# EAGLE design ! NES_IO_US_SNES_REV1.5 (EAGLE 9.1.3)
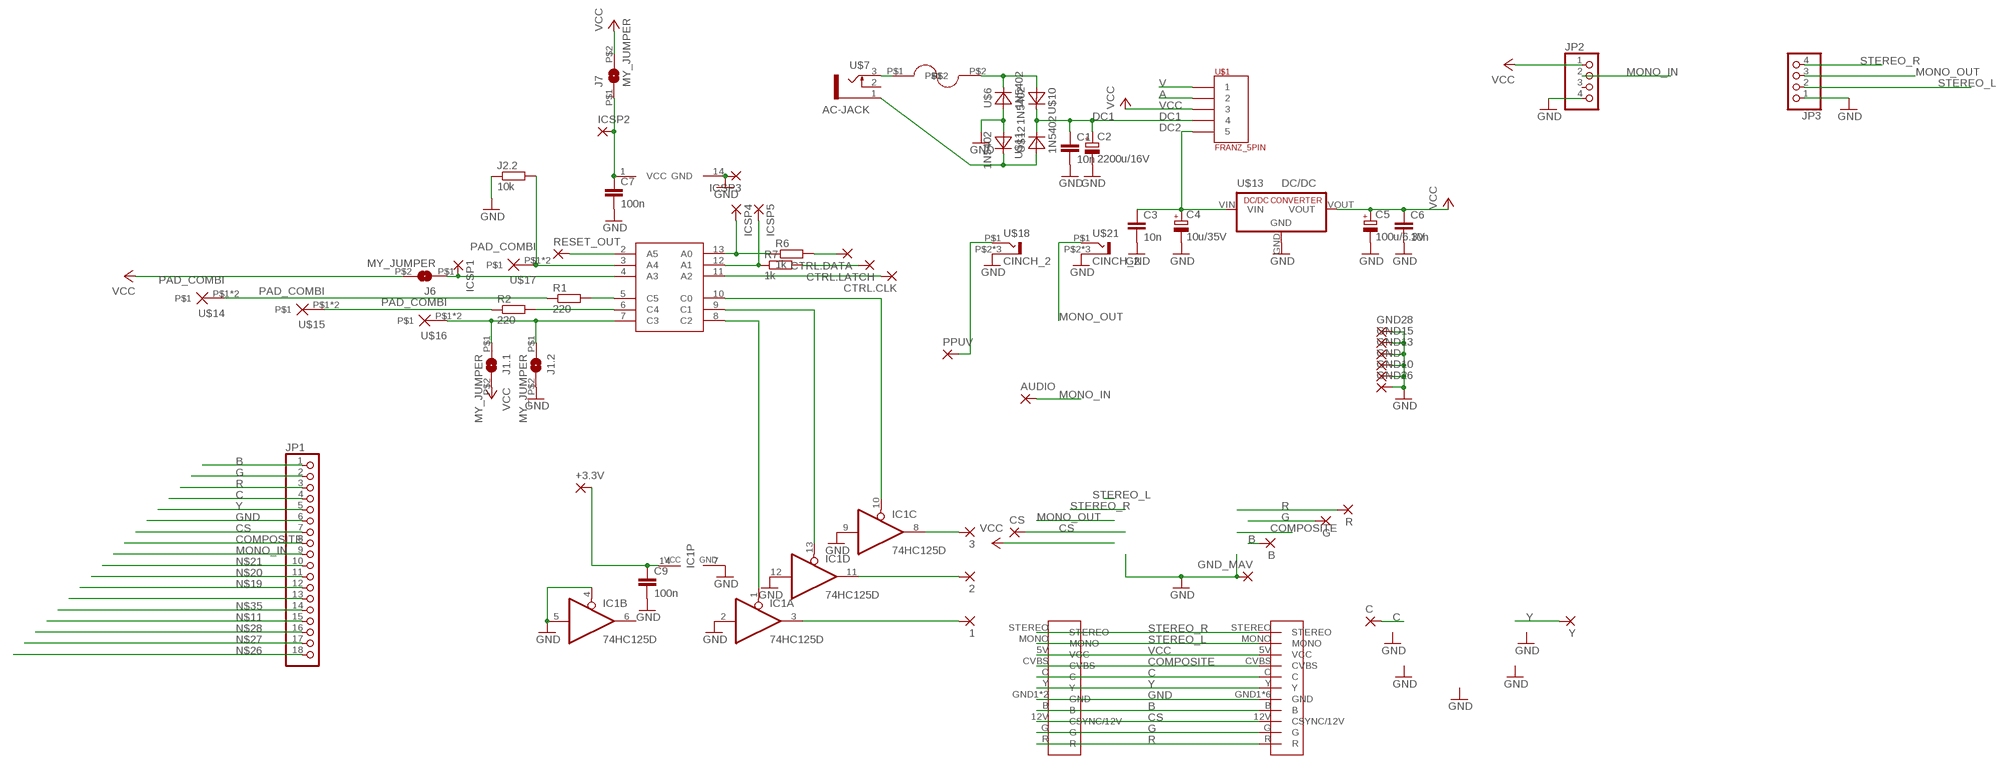
[diagram p0: schematic, sheet 1]

## Parts
1  SMD2  [SMD1,27-2,54]
2  SMD2  [SMD1,27-2,54]
3  SMD2  [SMD1,27-2,54]
+3.3V  SMD2  [SMD1,27-2,54]
AUDIO  SMD2  [SMD1,27-2,54]
B  SMD2  [SMD1,27-2,54]
C  SMD2  [SMD1,27-2,54]
C1  10n  C0805  [Z0805]
C2  2200u/16V  CPOL-EUE5-13  [E5-13]
C3  10n  C0805  [Z0805]
C4  10u/35V  CPOL-EUB  [PANASONIC_B]
C5  100u/6.3V  CPOL-EUD  [PANASONIC_D]
C6  10n  C0805  [Z0805]
C7  100n  C0805  [Z0805]
C9  100n  C0805  [Z0805]
CS  SMD2  [SMD1,27-2,54]
CTRL.CLK  SMD2  [SMD1,27-2,54]
CTRL.DATA  SMD2  [SMD1,27-2,54]
CTRL.LATCH  SMD2  [SMD1,27-2,54]
G  SMD2  [SMD1,27-2,54]
GND  SMD5  [SMD2,54-5,08]
GND10  SMD5  [SMD2,54-5,08]
GND13  SMD5  [SMD2,54-5,08]
GND15  SMD5  [SMD2,54-5,08]
GND26  SMD5  [SMD2,54-5,08]
GND28  SMD5  [SMD2,54-5,08]
GND_MAV  SMD2  [SMD1,27-2,54]
IC1  74HC125D  [SO14]
ICSP1  1,6/0,8  [1,6/0,8]
ICSP2  1,6/0,8  [1,6/0,8]
ICSP3  1,6/0,8  [1,6/0,8]
ICSP4  1,6/0,8  [1,6/0,8]
ICSP5  1,6/0,8  [1,6/0,8]
J1.1  MY_JUMPER  [MYJUMP]
J1.2  MY_JUMPER  [MYJUMP]
J2.2  10k  R0805  [Z0805]
J6  MY_JUMPER  [MYJUMP]
J7  MY_JUMPER  [MYJUMP]
JP1  PINHD-1X18_2.00  [1X18M]
JP2  PINHD-1X04_2.54-S  [1X04-S]
JP3  PINHD-1X04_2.54-S  [1X04-S]
PPUV  SMD2  [SMD1,27-2,54]
R  SMD2  [SMD1,27-2,54]
R1  220  R0805  [Z0805]
R2  220  R0805  [Z0805]
R6  1k  R0805  [Z0805]
R7  1k  R0805  [Z0805]
RESET_OUT  SMD2  [SMD1,27-2,54]
U$1  FRANZ_5PIN  [5X2.22RM4]
U$2  FUSEHOLDER  [FUSEHOLDER]
U$5  PIC16F630_SIMPLE  [PIC16F630]
U$6  1N5402  [DO201]
U$7  AC-JACK  [AC-JACK]
U$10  1N5402  [DO201]
U$11  1N5402  [DO201]
U$12  1N5402  [DO201]
U$13  DC/DC  [RECOM]
U$14  PAD_COMBI  [PAD_COMBI]
U$15  PAD_COMBI  [PAD_COMBI]
U$16  PAD_COMBI  [PAD_COMBI]
U$17  PAD_COMBI  [PAD_COMBI]
U$18  CINCH_2  [CINCH_2]
U$19  GC-MULTIAV  [GC-MULTIAV]
U$20  SNES-MULTIAV2  [SNES-MULTIAV2]
U$21  CINCH_2  [CINCH_2]
Y  SMD2  [SMD1,27-2,54]

## Nets
A: U$1.P$2
AC1A: U$2.P$1 U$7.3
AC1B: U$2.P$2 U$6.C U$10.A
AC2: U$7.1 U$11.C U$12.A
B: B.1(P) JP1.1 U$19.B U$20.B
C: C.1(P) JP1.4 U$19.C U$20.C
COMPOSITE: JP1.8 PPUV.1(P) U$18.P$1(T) U$19.CVBS U$20.CVBS
CS: CS.1(P) JP1.7 U$19.12V(CSYNC/12V) U$20.12V(CSYNC/12V)
DC1: C1.1 C2.+ U$1.P$4 U$10.C U$12.C
DC2: C3.1 C4.+ U$1.P$5 U$13.VIN
G: G.1(P) JP1.2 U$19.G U$20.G
GND: C1.2 C2.- C3.2 C4.- C5.- C6.2 C7.2 C9.2 GND10.1(P) GND13.1(P) GND15.1(P) GND26.1(P) GND28.1(P) GND.1(P) GND_MAV.1(P) IC1.2(A:I) IC1.4(B:OE) IC1.5(B:I) IC1.7(P:GND) IC1.9(C:I) IC1.12(D:I) ICSP3.1(P) J1.2.P$2 J2.2.1 JP1.6 JP2.4 JP3.1 U$5.14(GND) U$6.A U$11.A U$13.GND U$18.P$2(S) U$18.P$3(S) U$18.P$4(S) U$19.GND1(GND) U$19.GND2(GND) U$19.GND3(GND) U$19.GND4(GND) U$19.GND5(GND) U$19.GND6(GND) U$20.GND1(GND) U$20.GND2(GND) U$21.P$2(S) U$21.P$3(S) U$21.P$4(S)
MONO_IN: AUDIO.1(P) JP1.9 JP2.2
MONO_OUT: JP3.3 U$21.P$1(T)
N$11: 3.1(P) IC1.8(C:O) JP1.15
N$12: J2.2.2 U$5.3(A4) U$17.P$1 U$17.P$2
N$13: R1.2 U$5.5(C5)
N$14: R2.2 U$5.6(C4)
N$15: R1.1 U$14.P$1 U$14.P$2
N$16: R2.1 U$15.P$1 U$15.P$2
N$17: J1.1.P$1 J1.2.P$1 U$5.7(C3) U$16.P$1 U$16.P$2
N$19: CTRL.DATA.1(P) JP1.12 R6.2
N$20: CTRL.LATCH.1(P) JP1.11 R7.2
N$21: CTRL.CLK.1(P) JP1.10 U$5.11(A2)
N$23: IC1.10(C:OE) U$5.10(C0)
N$24: IC1.13(D:OE) U$5.9(C1)
N$25: IC1.1(A:OE) U$5.8(C2)
N$26: +3.3V.1(P) C9.1 IC1.14(P:VCC) JP1.18
N$27: 1.1(P) IC1.3(A:O) JP1.17
N$28: 2.1(P) IC1.11(D:O) JP1.16
N$29: JP1.13
N$31: C7.1 ICSP2.1(P) J7.P$1 U$5.1(VCC)
N$32: ICSP1.1(P) J6.P$1 U$5.4(A3)
N$33: ICSP4.1(P) R6.1 U$5.13(A0)
N$34: ICSP5.1(P) R7.1 U$5.12(A1)
N$35: JP1.14 RESET_OUT.1(P) U$5.2(A5)
R: JP1.3 R.1(P) U$19.R U$20.R
STEREO_L: JP3.2 U$19.MONO U$20.MONO
STEREO_R: JP3.4 U$19.STEREO U$20.STEREO
V: U$1.P$1
VCC: C5.+ C6.1 J1.1.P$2 J6.P$2 J7.P$2 JP2.1 U$1.P$3 U$13.VOUT U$19.5V(VCC) U$20.5V(VCC)
Y: JP1.5 U$19.Y U$20.Y Y.1(P)
Unconnected: IC1.6(B:O) JP2.3 U$7.2

## Library data of the parts
1-3 +3.3V AUDIO B C CS CTRL.CLK CTRL.DATA CTRL.LATCH G GND_MAV PPUV R RESET_OUT Y = wirepad:SMD2: SMD PAD
C1 C3 C6 C7 C9 = snes_div:C0805
C2 = resistor:CPOL-EU: POLARIZED CAPACITOR, European symbol
C4 C5 = rcl:CPOL-EU: POLARIZED CAPACITOR, European symbol
GND GND10 GND13 GND15 GND26 GND28 = wirepad:SMD5: SMD PAD
IC1 = 74xx-eu:74*125: Quad bus BUFFER, 3-state
ICSP1-ICSP5 = wirepad:1,6/0,8: THROUGH-HOLE PAD
J1.1 J1.2 J6 J7 = snes_div:MY_JUMPER
J2.2 R1 R2 R6 R7 = snes_div:R0805
JP1 = pinhead-2:PINHD-1X18: PIN HEADER
JP2 JP3 = pinhead-2:PINHD-1X04: PIN HEADER
U$1 = schnaustlib:FRANZ_5PIN
U$2 = nintendo:FUSEHOLDER
U$5 = snes_div:PIC16F630_SIMPLE
U$6 U$10-U$12 = nintendo:1N5402
U$7 = nintendo:AC-JACK
U$13 = nintendo:DC/DC
U$14-U$17 = MS_Mod:PAD_COMBI
U$18 U$21 = nintendo:CINCH_2
U$19 = nintendo:GC-MULTIAV
U$20 = nintendo:SNES-MULTIAV2

## Board
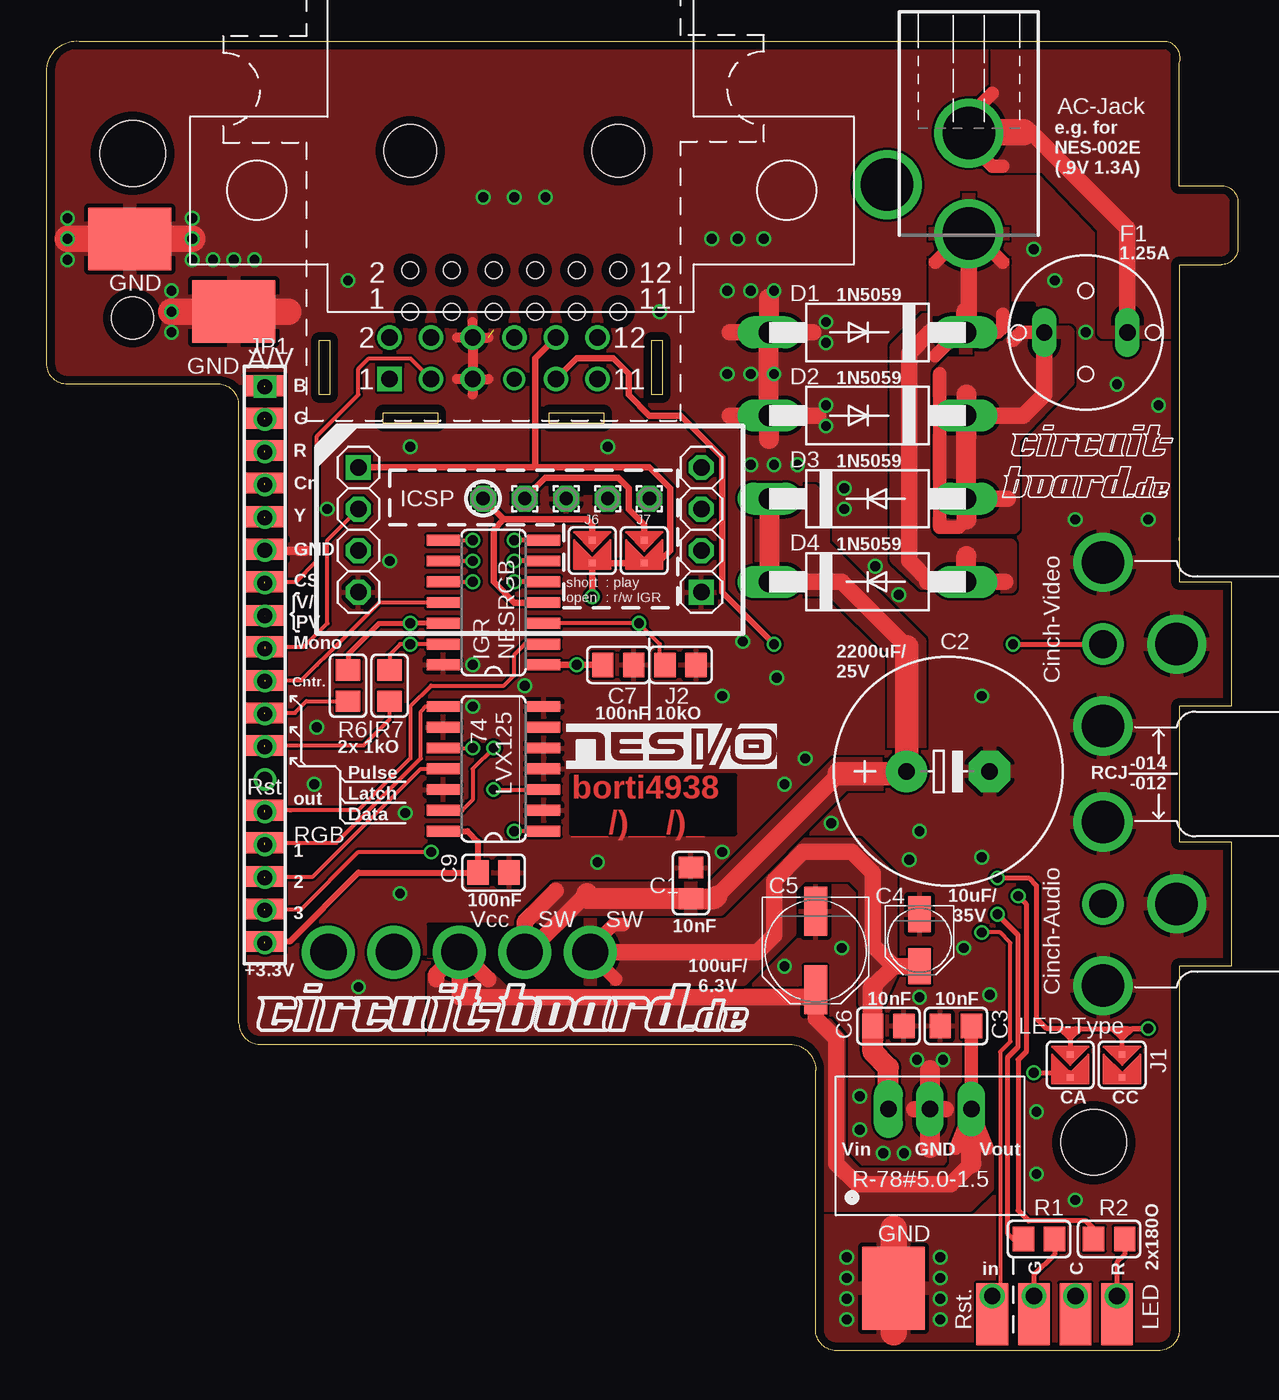
[diagram p1: board, top side]
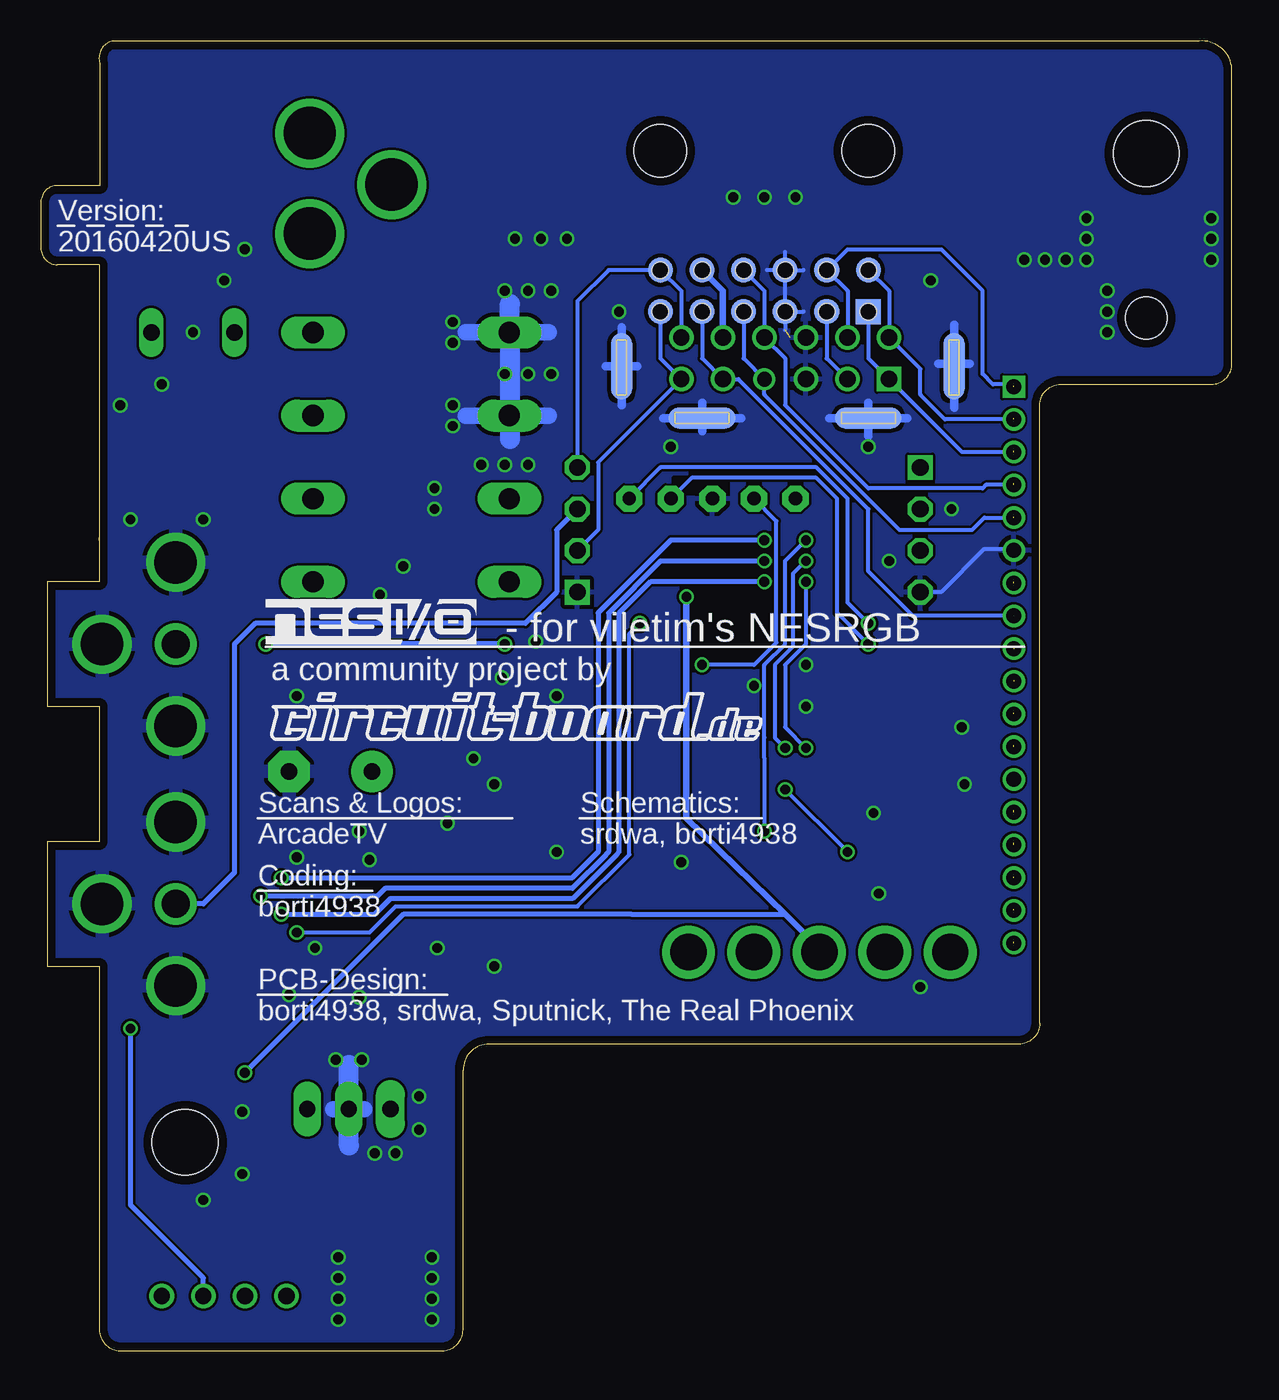
[diagram p2: board, bottom side, seen from below]

Size 72.79 x 80.04 mm. Coordinates in mm from the lower left corner, seen from the top.
Outline: 69.22,49.69 69.22,66.37 71.79,66.37 arc90 72.79,67.37 72.79,70.2 arc90 71.79,71.2 69.19,71.2 69.19,78.67 arc90 68.46,80.04 2,80.04 arc90 0,78.36 0,60.96 0,60.33 arc90 1.27,59.05 10.48,59.05 arc-90 11.75,57.78 11.75,20 arc90 13.02,18.73 45.4,18.73 arc-90 46.99,17.14 46.99,1.27 arc90 48.26,0 67.94,0 arc90 69.22,1.27 69.22,23.5 72.39,23.5 72.39,31.11 69.22,31.11 69.22,39.37 72.39,39.37 72.39,46.99 69.22,46.99 69.22,49.53
Outline: 69.22,49.69 69.22,49.53
Outline: 69.22,49.53 arc-7 69.22,49.69
Copper layers (1*16): Top 0.035mm / dielectric 1.6mm / Bottom 0.035mm
Design rules "Elecrow_2-layer_PCB_eagle_rule": minimum track width 6mil, minimum drill 12mil, track to track 6mil, track to pad 6mil, pad to pad 6mil, via to via 8mil, smd to smd 0mil, copper to edge 20mil, drill to drill 10mil, minimum pad ring 6mil, minimum via ring 6mil, stop-mask expansion 0mil, vias tented up to drill 100mil, thermal gap 10mil
Holes 4 mm at 5.25,73.16 63.98,12.73
Holes 2.54 mm at 5.25,63.11
tRestrict: area 61.9,10.7 to 66,14.7; area 3.2,71.2 to 7.3,75.2; area 23.3,24.1 to 28.1,26; area 30.8,52.4 to 34.1,53.3; area 12.1,24.3 to 14.6,59.7; area 59.1,62.5 to 60.3,64; area 57.3,13.3 to 58.6,20.6
bRestrict: area 61.9,10.7 to 66,14.7; area 3.2,71.2 to 7.3,75.2; area 30.8,52.4 to 34.1,53.3

### Footprints (pad centres in the part's own frame; a part is rotated, then mirrored left to right if it is on the bottom)
SMD1,27-2,54 = smd 1.27 x 2.54: 1 0,0
Z0805 = smd 1.3 x 1.5: 1 -0.95,0; 2 0.95,0
E5-13 = drill 1.016 pad 2.54: + -2.54,0 | drill 1.016 pad 2.54 octagon: - 2.54,0
PANASONIC_B = smd 2.2 x 1.4: + 1.6,0; - -1.6,0
PANASONIC_D = smd 3 x 1.4: + 2.4,0; - -2.4,0
SMD2,54-5,08 = smd 2.54 x 5.08: 1 0,0
SO14 = smd 0.66 x 2.032: 1 -3.81,-3.073; 2 -2.54,-3.073; 3 -1.27,-3.073; 4 0,-3.073; 5 1.27,-3.073; 6 2.54,-3.073; 7 3.81,-3.073; 8 3.81,3.073; 9 2.54,3.073; 10 1.27,3.073; 11 0,3.073; 12 -1.27,3.073; 13 -2.54,3.073; 14 -3.81,3.073
1,6/0,8 = drill 0.813 pad 1.6 octagon: 1 0,0
MYJUMP = smd 0.406 x 0.406: P$1 -0.635,0; P$2 0.765,0
1X18M = drill 0.914 square: 1 -17,0 | drill 0.914: 2 -15,0; 3 -13,0; 4 -11,0; 5 -9,0; 6 -7,0; 7 -5,0; 8 -3,0; 9 -1,0; 10 1,0; 11 3,0; 12 5,0; 13 7,0; 14 9,0; 15 11,0; 16 13,0; 17 15,0; 18 17,0
1X04-S = drill 1.016 square: 1 -3.81,0 | drill 1.016 octagon: 2 -1.27,0; 3 1.27,0; 4 3.81,0
5X2.22RM4 = drill 2.22: P$1 -8,0; P$2 -4,0; P$3 0,0; P$4 4,0; P$5 8,0
FUSEHOLDER = drill 1 pad 1.422 long: P$1 -2.54,0; P$2 2.54,0
PIC16F630 = smd 0.66 x 2.032: 1 -3.81,-3.073; 2 -2.54,-3.073; 3 -1.27,-3.073; 4 0,-3.073; 5 1.27,-3.073; 6 2.54,-3.073; 7 3.81,-3.073; 8 3.81,3.073; 9 2.54,3.073; 10 1.27,3.073; 11 0,3.073; 12 -1.27,3.073; 13 -2.54,3.073; 14 -3.81,3.073
DO201 = drill 1.3 long: A 6,0; C -6,0
AC-JACK = drill 3.2 pad 4: 1 0,8.57; 2 5,5.57; 3 0,2.42
RECOM = drill 1 pad 1.676 long: GND 0,0; VOUT 2.54,0 | drill 1 pad 1.778 long: VIN -2.54,0
PAD_COMBI = smd 1.93 x 3.81: P$1 0,0 | drill 1: P$2 0,1.111
CINCH_2 = drill 1.7: P$1 0,-4.5 | drill 2.6: P$2 -5,-4.5; P$3 5,-4.5; P$4 0,0
GC-MULTIAV = drill 1: 5V 15.24,5.08; 12V 7.62,2.54; B 7.62,5.08; C 12.7,5.08; CVBS 15.24,2.54; G 5.08,5.08; GND1 10.16,2.54; GND2 10.16,5.08; MONO 17.78,2.54; STEREO 17.78,5.08 | smd 1.27 x 4.064 bottom: GND3 1.111,3.334; GND6 21.431,3.334 | smd 4.064 x 1.27 bottom: GND4 6.35,0.159; GND5 16.51,0.159 | drill 1 square: R 5.08,2.54 | drill 0.9: Y 12.7,2.54
SNES-MULTIAV2 = smd 1.524 x 1.524 bottom: 5V 15.24,2.54; 12V 7.62,0; B 7.62,2.54; C 12.7,2.54; CVBS 15.24,0; G 5.08,2.54; GND1 10.16,0; GND2 10.16,2.54; MONO 17.78,0; R 5.08,0; STEREO 17.78,2.54; Y 12.7,0 | hole 3.2: 5.08,9.842; 17.78,9.842 | hole 1: 5.08,0; 5.08,2.54; 7.62,2.54; 10.16,2.54; 12.7,2.54; 12.7,0; 10.16,0; 7.62,0; 15.24,2.54; 17.78,2.54; 17.78,0; 15.24,0

### Placement (x,y rotation side)
1  13.34,26.99 270 top
2  13.34,28.97 270 top
3  13.34,31.04 270 top
+3.3V  13.34,25 90 top
AUDIO  13.34,43.02 90 top
B  13.34,58.98 90 top
C  13.34,53.02 90 top
C1  39.37,28.57 90 top
C2  55.09,35.4 0 top
C3  51.44,19.84 0 top
C4  53.34,25.08 270 top
C5  46.99,24.45 270 top
C6  55.56,19.84 180 top
C7  34.92,41.91 0 top
C9  27.3,29.21 0 top
CS  13.34,46.99 90 top
CTRL.CLK  13.34,40.96 270 top
CTRL.DATA  13.34,36.99 270 top
CTRL.LATCH  13.34,38.97 270 top
G  13.34,56.99 90 top
GND  5.08,68.58 90 top
GND10  51.12,3.81 180 top
GND13  52.39,3.81 0 top
GND15  11.43,62.87 90 top
GND26  11.43,64.14 90 top
GND28  5.08,67.31 90 top
GND_MAV  13.34,48.97 270 top
IC1  27.3,35.56 90 top
ICSP1  26.67,52.07 0 top
ICSP2  29.21,52.07 0 top
ICSP3  31.75,52.07 0 top
ICSP4  34.29,52.07 0 top
ICSP5  36.83,52.07 0 top
J1.1  62.55,17.46 270 top
J1.2  65.72,17.46 270 top
J2.2  38.73,41.91 180 top
J6  33.34,48.9 270 top
J7  36.51,48.9 270 top
JP1  13.34,41.91 270 top
JP2  19.05,50.16 270 top
JP3  40.01,50.16 90 top
PPUV  13.34,44.93 90 top
R  13.34,55.01 90 top
R1  60.64,6.83 180 top
R2  64.93,6.83 180 top
R6  20.95,40.64 270 top
R7  18.41,40.64 270 top
RESET_OUT  13.34,33.02 90 top
U$1  25.21,24.36 0 top
U$2  63.5,62.23 180 top
U$3  [NESIO-LOGO]  31.75,35.56 0 top
U$4  [NESIO-LOGO]  59.05,43.18 0 bottom
U$5  27.3,45.72 90 top
U$6  50.16,57.15 180 top
U$7  56.36,76.83 180 top
U$10  50.16,52.07 0 top
U$11  50.16,62.23 180 top
U$12  50.16,46.99 0 top
U$13  53.98,14.76 0 top
U$14  60.33,2.22 0 top
U$15  65.41,2.22 0 top
U$16  62.87,2.22 0 top
U$17  57.78,2.22 0 top
U$18  69.06,43.18 270 top
U$19  15.88,56.83 0 top
U$20  17.14,63.5 0 top
U$21  69.06,27.3 270 top
Y  13.34,50.96 90 top

### Tracks (layer width: path | path; a pad name or v marks a point on that pad's centre or on a via)
AC1A
  Top 0.813: 56.2,74.61 56.2,75.25 | 56.2,75.25 57.78,76.83 | 56.2,75.25 55.72,74.77 55.72,74.45 57.78,72.39 58.42,72.39
  Top 1.016: U$7.3 60.17,74.45 66.04,68.58 U$2.P$1
  Top 1.626: 59.69,74.45 56.2,74.45 56.2,74.61 56.2,74.77 56.04,74.61 56.04,74.45
  pour Top: 58.1,72.39 58.1,81.28 69.37,81.28 72.87,77.79 72.87,62.23 64.61,62.23 64.61,68.58 60.96,72.39
AC1B
  Top 0.813: U$2.P$2 59.53,62.23 59.05,61.75 | 54.58,59.69 54.58,50.32 55.72,50.32 56.2,50.8
  Top 1.016: U$6.C 56.2,57.15 59.69,57.15 60.96,58.42 60.96,61.75 | 56.2,52.07 58.74,52.07
  Top 1.219: U$6.C U$10.A | 56.2,52.07 56.2,50.8 | 56.2,55.88 56.2,57.15 56.2,58.42
  pour Top (rank 2): 54.29,50.32 59.05,50.32 59.05,55.72 62.39,59.21 62.39,62.23 59.53,62.23 57.63,60.64 55.09,60.64 54.29,59.85
AC2
  Top 0.813: 58.42,66.52 56.36,68.58 56.12,68.34 | 56.12,68.34 54.29,66.52 | U$7.1 56.12,68.27 56.12,68.34 | 56.2,62.23 58.1,62.23 58.42,62.55 58.42,63.34 | 54.29,60.8 55.88,62.39
  Top 1.016: U$7.1 56.36,62.23 56.2,62.23 U$11.C 53.98,62.23 52.7,60.96 52.7,48.26 53.98,46.99 U$12.A | 58.58,46.99 53.82,46.99
  Top 1.219: 56.2,62.23 56.2,63.5 | 56.2,46.99 56.2,48.58
  pour Top: 57.15,70.33 55.56,70.33 54.29,69.06 54.29,63.66 51.91,61.28 51.91,48.42 53.82,46.67 58.9,46.67 58.9,49.21 54.29,49.21 53.66,49.85 53.66,60.17 54.77,61.28 57.15,61.28 58.42,62.55 58.42,69.06
B  (1 unrouted)
  Bottom 0.254: U$19.B 23.5,64.77 U$20.B 23.5,67.31 17.78,67.31 15.24,64.77 15.24,59.69 14.61,59.05 13.48,59.05 JP1.1
C  (1 unrouted)
  Bottom 0.254: U$20.C 28.57,64.77 U$19.C 27.3,60.64 27.3,57.78 22.23,52.7 15.24,52.7 15.04,52.91 JP1.4
COMPOSITE  (via drill 0.6)  (1 unrouted)
  Top 0.305: v59.05,43.18 U$18.P$1
  Top 0.406: U$19.CVBS 32.38,60.64 34.61,60.64 35.56,59.69 35.56,58.42 36.83,57.15 38.73,57.15 41.27,54.61 41.27,46.35 v44.45,43.18
  Bottom 0.254: U$20.CVBS 32.38,60.64 U$19.CVBS 30.16,59.37 22.23,51.44 22.23,47.62 19.51,44.91 JP1.8
  Bottom 0.406: v59.05,43.18 46.07,43.18 46.05,43.17 46.04,43.18 v44.45,43.18
CS  (1 unrouted)
  Top 0.254: CS.1 15.24,46.99 16.51,48.26 16.51,55.88 19.05,58.42 19.05,60.01 19.68,60.64 22.23,60.64 U$19.12V
  Bottom 0.254: U$19.12V 24.77,60.64 U$20.12V
DC1
  Top 0.813: 29.21,26.35 29.53,26.67
  Top 1.016: U$12.C 48.58,46.99 52.55,43.02 | 48.42,35.24 40.96,27.78 | U$1.P$4 | 32.7,27.62 29.21,24.13 29.21,26.19 31.11,28.1
  Top 1.219: U$10.C U$12.C
  Top 1.27: 33.02,27.94 33.02,27.62 C1.1 40.8,27.62 40.96,27.78
  Top 1.422: 52.55,43.02 C2.+ | 52.55,35.24 48.42,35.24
  pour Top: 43.66,46.51 43.66,52.55 46.83,52.55 47.47,51.91 47.47,49.21 53.34,43.34 53.34,35.88 52.7,34.61 48.74,34.61 41.12,26.99 32.23,26.99 30.16,24.92 30.16,24.45 27.94,24.45 27.94,25.08 31.11,28.26 40.64,28.26 48.26,35.88 51.12,35.88 51.75,36.51 51.75,42.7 47.94,46.51
DC2
  Top 0.406: 53.35,23.5 C4.+
  Top 0.813: 35.24,26.04 34.61,26.04 33.02,24.45 34.77,22.7
  Top 1.016: U$1.P$5 43.41,24.36 44.45,25.4 44.45,28.73 46.2,30.48 49.21,30.48 50.48,29.21 50.48,24.77 51.75,23.5 | 51.75,23.5 53.33,23.5 C4.+ | 50.48,22.23 51.75,23.5 | 50.48,19.05 C3.1
  Top 1.219: C3.1 50.48,22.23
  Top 1.27: U$13.VIN 51.44,17.3 50.48,18.26 50.48,19.05
  pour Top (rank 2): 42.55,22.7 33.02,22.7 33.02,26.19 41.27,26.19 46.04,30.96 49.53,30.96 51.59,28.89 51.59,23.02 50.8,21.27 50.01,21.27 50.01,28.26 49.21,29.05 46.2,29.05 45.4,28.26 45.4,25.56
G  (1 unrouted)
  Bottom 0.254: U$20.G 20.95,64.77 U$19.G 19.05,60.01 19.05,58.42 17.54,56.91 JP1.2
GND  (via drill 0.6)  (1 unrouted)
  Top 0.508: GND_MAV.1 13.41,48.9 15.32,48.9
  Top 0.61: U$19.GND2 U$19.GND1 | U$19.GND1 26.04,58.42 | U$19.GND1 25.08,59.37 | U$19.GND1 26.99,59.37 | U$19.GND2 25.08,61.91 | U$19.GND2 26.99,61.91 | U$19.GND2 26.04,62.87 | 15.32,48.9 15.88,48.9
  Top 1.016: 10.16,64.14 GND26.1 | 41.75,57.15 44.13,57.15 47.15,57.15 | 46.83,62.23 44.13,62.23 41.75,62.23 | 53.02,14.76 U$13.GND 54.93,14.76
  Top 1.219: 44.13,64.29 44.13,62.23 44.13,57.15 44.13,55.72 | 53.98,17.14 U$13.GND 53.98,12.38
  Top 1.626: v1.27,67.94 v8.89,67.94 | v7.62,63.5 14.76,63.5 | 51.75,7.46 51.75,1.11
  Bottom 0.254: U$20.GND1 U$20.GND2 | U$20.GND1 26.19,63.5 | U$20.GND2 26.19,66.04 | U$20.GND2 28.42,66.04 | U$20.GND2 27.3,67.15 | U$20.GND1 27.3,62.39 | GND_MAV.1 15.16,48.97 17.78,46.35 JP2.4
  Bottom 0.508: U$19.GND3 16.99,57.63 | U$19.GND3 16.99,62.71 | U$19.GND4 19.84,56.99 | U$19.GND4 24.61,56.99 | U$19.GND4 22.23,57.94 | U$19.GND4 22.23,55.88 | U$19.GND3 16.83,60.33 16.03,60.33 | U$19.GND3 17.14,60.33 17.94,60.33 | U$19.GND5 30,56.99 | U$19.GND5 34.77,56.99 | U$19.GND5 32.38,57.94 | U$19.GND5 32.38,56.2 | U$19.GND6 37.31,57.78 | U$19.GND6 37.31,62.55 | U$19.GND6 36.35,60.17 | U$19.GND6 38.26,60.17
  Bottom 1.016: 41.75,62.23 44.13,62.23 46.83,62.23 | 46.83,57.15 44.13,57.15 41.75,57.15 | 53.02,14.76 U$13.GND 54.93,14.76
  Bottom 1.219: 44.13,63.98 44.13,62.23 44.13,57.15 44.13,55.72 | 53.98,17.46 U$13.GND 53.98,12.54
  other vias: 29.21,40.64 33.66,29.84 11.43,66.67 10.16,66.67 8.89,69.22 7.62,64.77 7.62,62.23 1.27,69.22 1.27,66.67 12.7,66.67 19.05,22.23 42.55,43.34 21.59,27.94 45.09,23.5 48.9,5.71 48.9,4.45 48.9,3.17 48.9,1.91 54.61,5.71 54.61,4.45 54.61,3.17 54.61,1.91 60.48,14.61 62.87,9.21 26.04,39.37 41.27,30.48 45.88,54.13 43.02,64.77 44.45,64.77 41.59,64.77 47.62,61.59 52.07,46.2 52.7,30 53.34,31.75 67.94,57.78 67.31,50.8 53.34,21.59 57.63,21.75 52.39,12.06 57.15,40.01 43.02,59.69 41.59,59.69 49.69,15.56 47.62,62.87 48.58,24.61 51.12,12.06 16.51,38.1 18.41,65.41 47.62,56.52 47.62,57.78 26.04,41.91 60.33,67.31 46.35,36.2 44.45,59.69 50.64,47.94 63.5,62.23 65.41,59.05 61.59,65.41 44.61,41.12 62.87,50.8 57.15,30.16 45.09,34.61 48.74,52.7 47.94,32.23 48.74,51.44 21.91,32.86 41.27,40.01 60.48,10.79 22.23,55.24 26.67,70.48 56.04,24.61 49.69,13.49 53.18,17.78 54.77,17.78 16.35,34.61 42.23,67.94 43.02,54.13 44.45,54.13 40.64,67.94 43.81,67.94 34.29,55.24 30.48,70.48 8.89,66.67 28.57,70.48 17.14,51.44 20.95,48.26 37.47,63.5
  pour Top (rank 5): 0,47.62 0,71.12 11.43,71.12 11.43,67.31 16.51,67.31 16.51,47.62
  pour Top (rank 5): 48.26,7.62 55.88,7.62 55.88,0 48.26,0
  pour Bottom (rank 5): 59.69,38.1 55.09,38.1 55.09,33.02 59.69,33.02
  pour Top (rank 5): 59.69,38.1 55.09,38.1 55.09,33.02 59.69,33.02
  pour Bottom: 62.23,50.48 73.03,50.73 73.03,20.16 62.23,20.16
  pour Top: 62.23,50.48 73.03,50.48 73.03,20.16 62.23,20.16
  pour Top (rank 6): 0,0 72.87,0 72.87,66.36 72.87,81.44 0,81.44
  pour Bottom (rank 6): 0,0 72.87,0 72.87,66.36 72.87,81.44 0,81.44
MONO_IN  (1 unrouted)
  Top 0.254: JP2.2 17.14,49.53 17.14,44.45 15.72,43.02 AUDIO.1
MONO_OUT
  Bottom 0.305: U$21.P$1 62.87,27.3 60.96,29.21 60.96,43.18 59.69,44.45 43.18,44.45 41.27,46.35 41.27,50.16 JP3.3
N$11  (1 unrouted)
  Top 0.254: IC1.8 23.18,39.37 22.86,39.05 22.86,36.2 17.7,31.04 3.1
N$12  (via drill 0.6)
  Top 0.254: U$17.P$2 58.26,3.65 58.26,18.26 58.9,18.89 58.9,24.92 58.26,25.56 v57.15,25.56 | U$5.3 v36.2,44.45 37.47,43.18 37.46,43.18 37.46,41.91 J2.2.2
  Top 0.305: U$17.P$1 U$17.P$2
  Bottom 0.254: v57.15,25.56 52.7,25.56 51.12,27.15 40.01,27.15 36.83,30.32 36.83,43.81 v36.2,44.45
N$13  (via drill 0.6)
  Top 0.305: U$5.5 v28.57,46.99 | R1.2 59.05,6.83 58.74,7.14 58.74,17.94 59.37,18.57 59.37,25.4 v58.1,26.67
  Bottom 0.305: v58.1,26.67 52.39,26.67 51.44,27.62 40.64,27.62 40.3,27.62 37.64,30.28 37.64,30.3 37.47,30.48 37.47,45.06 35.54,46.99 v28.57,46.99
N$14  (via drill 0.6)
  Top 0.305: U$5.6 v28.57,48.26 | R2.2 63.98,7.46 63.5,7.94 60.01,7.94 59.37,8.57 59.37,17.78 59.85,18.26 59.85,27.3 v59.37,27.78
  Bottom 0.305: v59.37,27.78 52.23,27.78 51.75,28.26 40.31,28.26 38.28,30.29 38.28,30.3 38.1,30.48 38.1,45.07 34.91,48.26 v28.57,48.26
N$15
  Top 0.305: U$14.P$1 U$14.P$2 60.33,4.6 61.59,5.87 R1.1
N$16
  Top 0.305: U$15.P$1 U$15.P$2 65.41,5.4 65.88,5.87 R2.1
N$17  (via drill 0.6)
  Top 0.305: U$5.7 v28.57,49.53 | U$16.P$1 U$16.P$2 | 62.55,19.05 J1.1.P$1 | 65.41,18.41 J1.2.P$1 65.72,19.05 | 62.55,19.05 61.91,19.68 | 65.72,19.05 65.09,19.68 | 61.91,19.68 62.87,19.68 | 62.87,19.68 63.18,19.68 | 63.18,19.68 62.55,19.05 | 62.55,19.05 62.55,19.21 62.23,19.53 62.55,19.53 62.71,19.37 62.71,19.53 62.87,19.68 | 63.18,19.68 65.09,19.68 | 65.09,19.68 65.25,19.68 | 65.25,19.68 65.72,19.68 | 66.04,19.68 v67.31,19.68 66.36,19.68 65.72,19.05 | 65.72,19.05 65.72,19.37 66.04,19.68 | 66.04,19.68 65.72,19.68 | 65.72,19.68 65.56,19.53 65.41,19.53 65.25,19.68 | 61.91,19.68 61.12,19.68 60.48,20.32 60.48,28.42 60.01,28.89 v58.1,28.89
  Bottom 0.305: v58.1,28.89 40.32,28.89 38.73,30.48 38.73,45.09 34.29,49.53 v28.57,49.53 | U$16.P$2 62.87,4.45 67.31,8.89 v67.31,19.68
N$19  (1 unrouted)
  Top 0.254: CTRL.DATA.1 19.37,36.99 20.95,38.58 R6.2
N$20  (1 unrouted)
  Top 0.254: 18.41,39.53 R7.2 15.88,39.69 15.16,38.97 CTRL.LATCH.1
N$21  (1 unrouted)
  Top 0.254: U$5.11 20.32,45.72 17.14,42.55 16.51,41.91 15.56,40.96 CTRL.CLK.1
N$23  (via drill 0.6)
  Top 0.254: 24.29,36.83 IC1.10 v26.04,36.83 | U$5.10 v26.04,46.99
  Bottom 0.254: v26.04,46.99 26.04,43.18 27.3,41.91 27.3,38.1 v26.04,36.83
N$24  (via drill 0.6)
  Top 0.254: U$5.9 v26.04,48.26 | v27.3,36.83 26.04,35.56 26.04,33.66 25.4,33.02 IC1.13
  Bottom 0.254: v26.04,48.26 26.83,47.47 26.83,43.02 27.94,41.91 27.94,37.47 v27.3,36.83
N$25  (via drill 0.6)
  Top 0.254: U$5.8 v26.04,49.53 | IC1.1 28.73,31.75 v28.57,31.75
  Bottom 0.254: v26.04,49.53 27.3,48.26 27.3,43.18 28.57,41.91 28.57,37.47 28.57,36.2 v28.57,31.75
N$26  (1 unrouted)
  Top 0.254: C9.1
  Top 0.356: C9.1 26.35,31.11 25.72,31.75 IC1.14 | C9.1 19.05,29.21 14.84,25 +3.3V.1
N$27  (via drill 0.6)  (1 unrouted)
  Top 0.254: 1.1 15.56,26.99 19.05,30.48 21.43,30.48 v23.5,30.48 | v27.3,34.29 IC1.3
  Bottom 0.254: v23.5,30.48 v27.3,34.29
N$28  (1 unrouted)
  Top 0.254: IC1.11 22.86,35.56 16.27,28.97 2.1
N$31  (via drill 0.6)
  Top 0.305: 34.13,41.91 C7.1 v32.38,41.91
  Top 0.406: C7.1 U$5.1 | ICSP2.1 30.48,53.34 34.92,53.34 35.56,52.7 35.56,51.44 36.51,50.48 J7.P$1
  Bottom 0.254: v32.38,41.91 29.21,41.91 28.57,42.55 27.84,43.28 27.84,50.7 ICSP2.1
N$32
  Top 0.406: J6.P$1 33.34,50.48 33.02,50.8 27.94,50.8 | U$5.4 28.57,45.72 27.3,46.99 27.3,50.16 27.94,50.8 | 27.94,50.8 ICSP1.1
N$33  (via drill 0.6)
  Top 0.254: R6.1 20.95,42.55 21.59,43.18 v22.23,43.18 U$5.13
  Bottom 0.254: v22.23,43.18 24.13,45.09 24.13,52.07 25.4,53.34 33.02,53.34 ICSP4.1
N$34  (via drill 0.6)
  Top 0.305: R7.1 18.41,41.43 18.41,42.55 20.32,44.45 v22.23,44.45 U$5.12
  Bottom 0.254: v22.23,44.45 23.5,45.72 23.5,52.07 25.4,53.98 34.92,53.98 ICSP5.1
N$35  (1 unrouted)
  Top 0.254: U$5.2 29.21,43.18 28.57,42.55 28.57,41.27 27.94,40.64 23.5,40.64 22.23,39.37 22.23,36.83 22.23,36.67 22.23,36.2 19.05,33.02 14.92,33.02 14.86,33.02 RESET_OUT.1
R  (1 unrouted)
  Bottom 0.254: U$20.R 22.23,60.64 U$19.R 16.49,54.91 JP1.3
STEREO_L
  Bottom 0.254: U$20.MONO 34.92,60.64 U$19.MONO 38.73,54.29 38.73,50.16 JP3.2
STEREO_R
  Bottom 0.254: U$19.STEREO 33.66,64.77 U$20.STEREO 38.1,66.04 40.01,64.14 JP3.4
VCC  (via drill 0.6)
  Top 0.305: v60.33,16.99 62.52,16.99 J1.1.P$2
  Top 0.406: U$19.5V 29.84,60.64 29.84,57.78 29.84,53.98 | 29.84,53.98 JP2.1 | 29.84,53.98 36.83,53.98 38.1,52.7 38.1,48.9 37.47,48.26 36.64,48.26 J7.P$2 J6.P$2 33.34,46.7 v33.34,46.07
  Top 0.813: U$13.VOUT 56.52,20 | U$13.VOUT 55.56,12.38 | U$13.VOUT 57.47,12.38
  Top 1.016: 56.52,20 C6.1 | U$1.P$3 25.21,24.32 25.24,24.29 | 25.24,24.29 25.24,21.59 46.53,21.59 C5.+ 46.99,20.32 48.26,19.05 48.26,11.43 49.53,10.16 55.24,10.16 56.52,11.43 | 25.24,24.29 25.08,24.29 23.81,23.02 23.81,22.7 | 25.24,24.45 26.99,22.7
  Top 1.219: 56.52,11.43 U$13.VOUT
  Bottom 0.305: 27.3,26.67 29.53,26.67 36.67,26.67 50.64,26.67 v60.33,16.99
  Bottom 0.406: U$1.P$3 25.21,24.58 27.3,26.67 33.34,32.54 v33.34,46.07 | U$20.5V 31.11,64.77 U$19.5V
  pour Top (rank 3): 57.47,12.38 55.56,12.38 55.56,11.27 55.09,10.79 49.53,10.79 48.42,11.91 48.42,19.05 46.2,21.75 28.26,21.59 26.35,23.5 26.35,24.13 25.56,24.92 23.65,24.92 23.65,18.73 46.99,18.73 46.99,8.89 56.36,8.89 57.47,10
Y  (1 unrouted)
  Bottom 0.254: 29.84,64.14 U$20.Y 29.84,60.64 U$19.Y 28.57,58.42 20.32,50.16 15.88,50.16 15.13,50.91 JP1.5

### Text on the board
Top: borti4938 / __/)__/)_
tNames: AC-Jack | e.g. for / NES-002E / ( 9V 1.3A) | ~ | F1 | 1.25A | GND | D1 | 1N5059 | GND | A/V | B | D2 | 1N5059 | G | R | D3 | 1N5059 | Cr | ICSP | Y | J6 | J7 | GND | D4 | 1N5059 | CS | short / open | : play / : r/w IGR | V/ / PV | Mono | C2 | IGR / NESRGB | Cntr. | 2200uF/ / 25V | Cinch-Video | C7 | J2 | 74 / LVX125 | 100nF | 10kO | 2x | R6|R7 | 1kO | Pulse | RCJ | Rst. | Latch | -014 / -012 | out | Data | RGB | 1 | C9 | 2 | C1 | C5 | 100nF | C4 | 3 | Vcc | SW | SW | 10nF | 10uF/ / 35V | +3.3V | 100uF/ / 6.3V | Cinch-Audio | 10nF | 10nF | C6 | C3 | LED-Type | J1 | CA | CC | Vin | GND | Vout | R-78#5.0-1.5 | R1 | R2 | GND | in | G | C | R | 2x180O | Rst. | LED
bNames: Version: / 20160420US | - for viletim's NESRGB | a community project by | Schematics: / srdwa, borti4938 | Scans & Logos: / ArcadeTV | Coding: / borti4938 | PCB-Design: / borti4938, srdwa, Sputnick, The Real Phoenix
tStop: b | o | r | t | i | 4 | 9 | 3 | 8 | _ | _ | / | ) | _ | _ | / | ) | _